# EAGLE schematic Schematic (EAGLE 9.6.2)
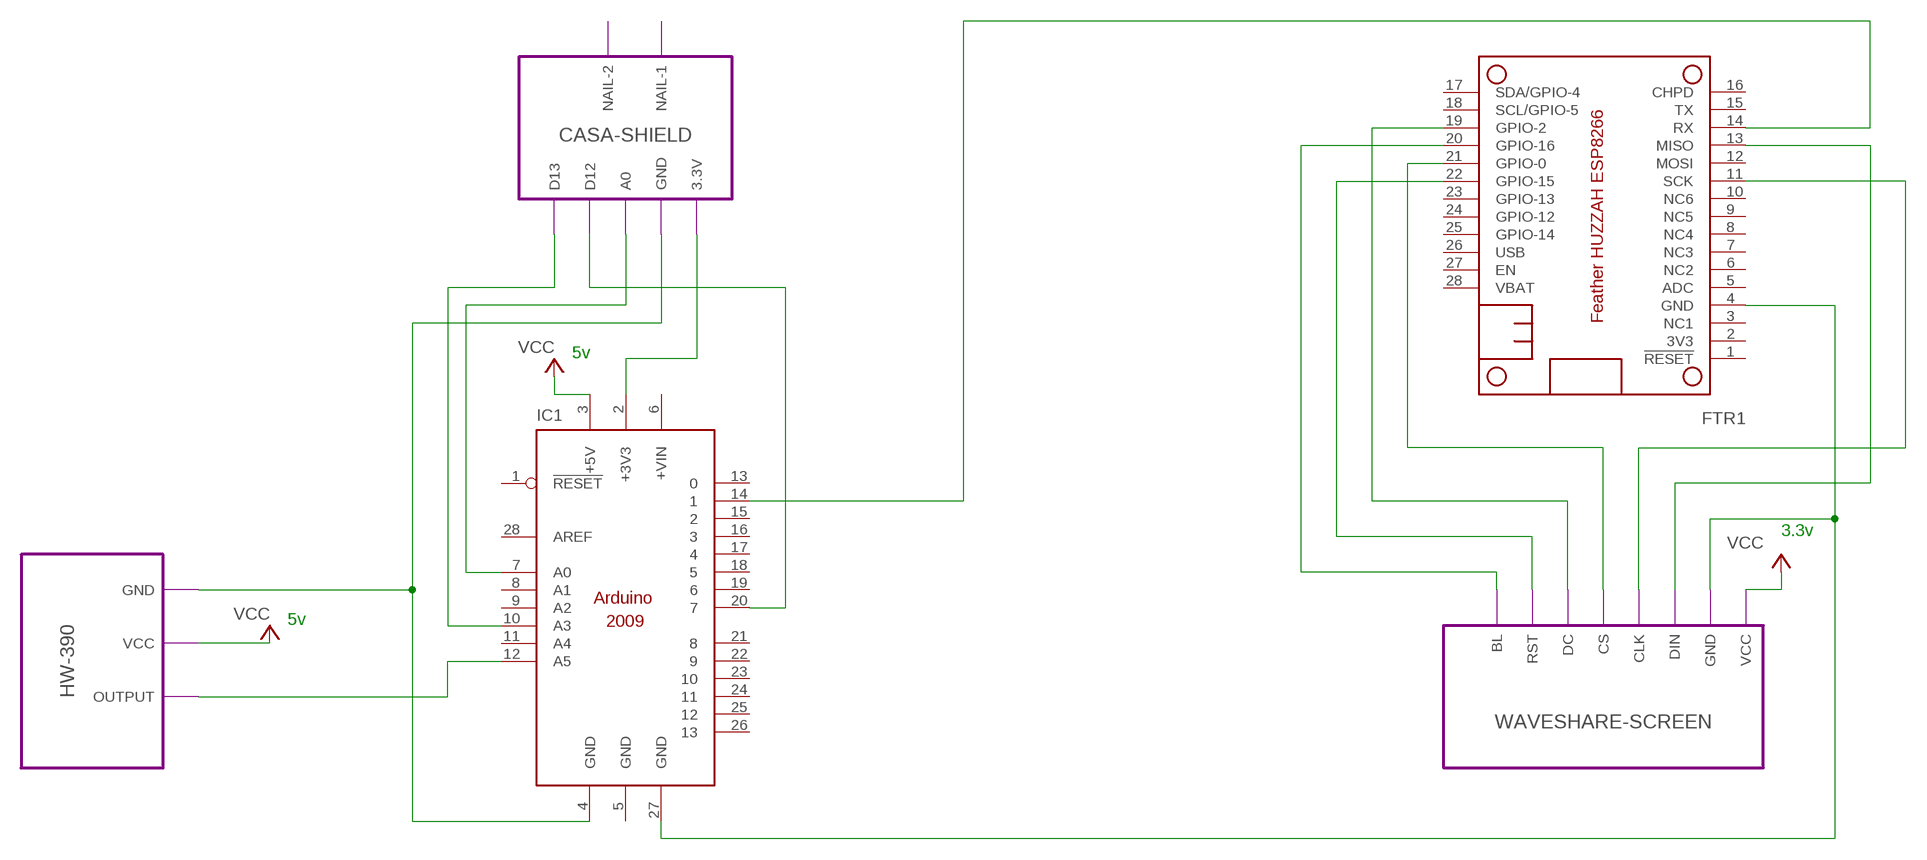
[diagram p0: schematic, sheet 1]

## Parts
FTR1  FEATHER_HUZZAH_ESP8266  [FEATHER]
IC1  ARDUINO2009_12  [ARDUINO2009_2]

## Module instances
CASA-SHIELD = DS
WAVESHARE-SCREEN = WAVESHARE-SCREEN
HW-390 = HW-390

## Nets
GND: FTR1.4(GND) IC1.27(GND) ; port WAVESHARE-SCREEN.GND
N$1: IC1.2(+3V3) ; port CASA-SHIELD.3.3V
N$2: IC1.4(GND) ; port CASA-SHIELD.GND HW-390.GND
N$3: IC1.7(A0) ; port CASA-SHIELD.A0
N$4: IC1.20 ; port CASA-SHIELD.D12
N$5: IC1.10(A3) ; port CASA-SHIELD.D13
N$6: IC1.12(A5) ; port HW-390.OUTPUT
N$7: FTR1.13(MISO) ; port WAVESHARE-SCREEN.DIN
N$8: FTR1.11(SCK) ; port WAVESHARE-SCREEN.CLK
N$9: FTR1.21(GPIO-0) ; port WAVESHARE-SCREEN.CS
N$10: FTR1.19(GPIO-2) ; port WAVESHARE-SCREEN.DC
N$11: FTR1.22(GPIO-15) ; port WAVESHARE-SCREEN.RST
N$12: FTR1.20(GPIO-16) ; port WAVESHARE-SCREEN.BL
N$13: FTR1.14(RX) IC1.14
VCC: IC1.3(+5V) ; port HW-390.VCC WAVESHARE-SCREEN.VCC
Unconnected: FTR1.1(!RESET) FTR1.2(3V3) FTR1.3(NC1) FTR1.5(ADC) FTR1.6(NC2) FTR1.7(NC3) FTR1.8(NC4) FTR1.9(NC5) FTR1.10(NC6) FTR1.12(MOSI) FTR1.15(TX) FTR1.16(CHPD) FTR1.17(SDA/GPIO-4) FTR1.18(SCL/GPIO-5) FTR1.23(GPIO-13) FTR1.24(GPIO-12) FTR1.25(GPIO-14) FTR1.26(USB) FTR1.27(EN) FTR1.28(VBAT) IC1.1(!RESET) IC1.6(+VIN) IC1.8(A1) IC1.9(A2) IC1.11(A4) IC1.13 IC1.15 IC1.16 IC1.17 IC1.18 IC1.19 IC1.21 IC1.22 IC1.23 IC1.24 IC1.25 IC1.26 IC1.28(AREF)

## Notes on the sheet
- 5v
- 3.3v
- 5v

## Power pins joined to a net without a drawn wire
GND: IC1.5(GND)

## Library data of the parts
FTR1 = adafruit-supplemental-arkane:FEATHER_HUZZAH_ESP8266: Adafruit Feather HUZZAH ESP8266.
IC1 = arduino:ARDUINO2009_1: The Arduino Duemilanove ("2009") is a microcontroller board based on the ATmega168 or ATmega328. - 14 digital input/output pins (of which 6 can be used as PWM outputs) - 6 analog inputs, a 16 MHz crystal oscillator - USB connection - power jack - ISP header - reset button It contains everything needed to support the microcontroller; simply connect it to a computer with a USB cable or power it with a AC-to-DC adapter or battery to get started http://arduino.cc/en/Main/ArduinoBoardDuemilanove

## Module DS
Ports: 3.3V(io) GND(io) A0(io) D12(io) D13(io) NAIL-1(io) NAIL-2(io)

### Library data of the parts

## Module NAILS
Ports: 

### Library data of the parts

## Module WAVESHARE-SCREEN
Ports: VCC(io) GND(io) DIN(io) CLK(io) CS(io) DC(io) RST(io) BL(io)

### Library data of the parts

## Module HW-390
Ports: GND(io) VCC(io) OUTPUT(io)

### Library data of the parts